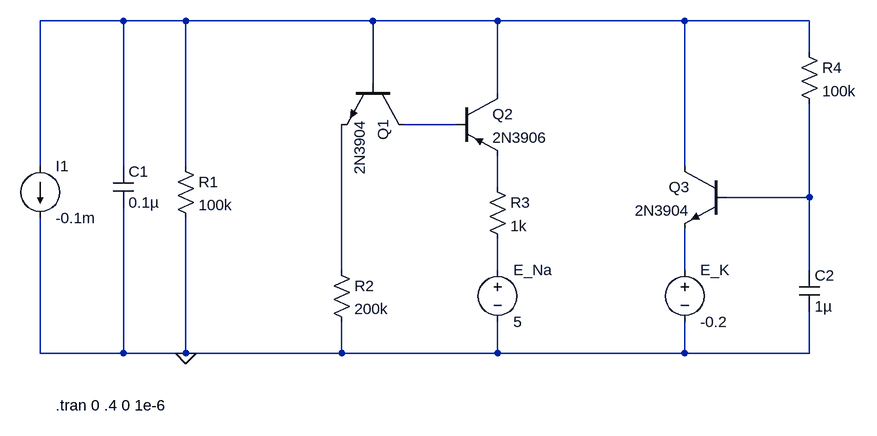
[diagram p0: schematic fhn_model.asc]
fhn_model.asc, the LTspice schematic file:
Version 4
SHEET 1 1256 680
WIRE 112 16 -16 16
WIRE 208 16 112 16
WIRE 496 16 208 16
WIRE 688 16 496 16
WIRE 976 16 688 16
WIRE 1168 16 976 16
WIRE 1168 64 1168 16
WIRE 496 112 496 16
WIRE 688 128 688 16
WIRE 624 176 544 176
WIRE -16 240 -16 16
WIRE 112 240 112 16
WIRE 208 240 208 16
WIRE 976 240 976 16
WIRE 688 272 688 224
WIRE 1168 288 1168 144
WIRE 1168 288 1040 288
WIRE 448 400 448 176
WIRE 688 400 688 352
WIRE 976 400 976 336
WIRE 1168 400 1168 288
WIRE -16 528 -16 320
WIRE 112 528 112 304
WIRE 112 528 -16 528
WIRE 208 528 208 320
WIRE 208 528 112 528
WIRE 448 528 448 480
WIRE 448 528 208 528
WIRE 688 528 688 480
WIRE 688 528 448 528
WIRE 976 528 976 480
WIRE 976 528 688 528
WIRE 1168 528 1168 464
WIRE 1168 528 976 528
FLAG 208 528 0
SYMBOL cap 96 240 R0
SYMATTR InstName C1
SYMATTR Value 0.1µ
SYMBOL voltage 688 384 R0
WINDOW 123 0 0 Left 0
WINDOW 39 0 0 Left 0
SYMATTR InstName E_Na
SYMATTR Value 5
SYMBOL current -16 240 R0
WINDOW 123 0 0 Left 0
WINDOW 39 0 0 Left 0
SYMATTR InstName I1
SYMATTR Value -0.1m
SYMBOL res 192 224 R0
SYMATTR InstName R1
SYMATTR Value 100k
SYMBOL npn 544 112 R90
SYMATTR InstName Q1
SYMATTR Value 2N3904
SYMBOL res 432 384 R0
SYMATTR InstName R2
SYMATTR Value 200k
SYMBOL res 672 256 R0
SYMATTR InstName R3
SYMATTR Value 1k
SYMBOL pnp 624 128 R0
SYMATTR InstName Q2
SYMATTR Value 2N3906
SYMBOL npn 1040 240 M0
SYMATTR InstName Q3
SYMATTR Value 2N3904
SYMBOL voltage 976 384 R0
WINDOW 123 0 0 Left 0
WINDOW 39 0 0 Left 0
SYMATTR InstName E_K
SYMATTR Value -0.2
SYMBOL res 1152 48 R0
SYMATTR InstName R4
SYMATTR Value 100k
SYMBOL cap 1152 400 R0
SYMATTR InstName C2
SYMATTR Value 1µ
TEXT 8 608 Left 2 !.tran 0 .4 0 1e-6

The netlist it stands for:
* fhn_model.asc
C1 N001 0 0.1µ
V§E_Na N006 0 5
I1 N001 0 -0.1m
R1 N001 0 100k
Q1 N002 N001 N005 0 2N3904
R2 N005 0 200k
R3 N003 N006 1k
Q2 N001 N002 N003 0 2N3906
Q3 N001 N004 N007 0 2N3904
V§E_K N007 0 -0.2
R4 N001 N004 100k
C2 N004 0 1µ
.model NPN NPN
.model PNP PNP
.lib standard.bjt
.tran 0 .4 0 1e-6
.backanno
.end